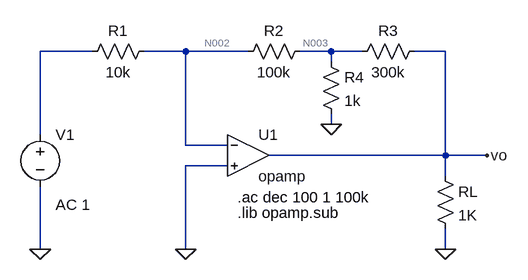
[diagram p0: schematic Ej_1_b.asc]
Ej_1_b.asc, the LTspice schematic file:
Version 4
SHEET 1 880 680
WIRE -128 16 -208 16
WIRE 16 16 -48 16
WIRE 112 16 16 16
WIRE 240 16 192 16
WIRE 288 16 240 16
WIRE 416 16 368 16
WIRE 240 32 240 16
WIRE 240 128 240 112
WIRE -208 144 -208 16
WIRE 16 160 16 16
WIRE 80 160 16 160
WIRE 416 176 416 16
WIRE 416 176 144 176
WIRE 480 176 416 176
WIRE 80 192 16 192
WIRE 416 208 416 176
WIRE -208 320 -208 224
WIRE 16 320 16 192
WIRE 416 320 416 288
FLAG 16 320 0
FLAG -208 320 0
FLAG 480 176 vo
FLAG 416 320 0
FLAG 240 128 0
SYMBOL res -32 0 R90
WINDOW 0 0 56 VBottom 2
WINDOW 3 32 56 VTop 2
SYMATTR InstName R1
SYMATTR Value 10k
SYMBOL res 208 0 R90
WINDOW 0 0 56 VBottom 2
WINDOW 3 32 56 VTop 2
SYMATTR InstName R2
SYMATTR Value 100k
SYMBOL voltage -208 128 R0
WINDOW 3 24 152 Left 2
WINDOW 123 24 124 Left 2
WINDOW 39 0 0 Left 0
SYMATTR Value ""
SYMATTR Value2 AC 1
SYMATTR InstName V1
SYMBOL OpAmps\\opamp 112 112 R0
SYMATTR InstName U1
SYMBOL res 400 192 R0
SYMATTR InstName RL
SYMATTR Value 1K
SYMBOL res 224 16 R0
SYMATTR InstName R4
SYMATTR Value 1k
SYMBOL res 384 0 R90
WINDOW 0 0 56 VBottom 2
WINDOW 3 32 56 VTop 2
SYMATTR InstName R3
SYMATTR Value 300k
TEXT 96 240 Left 2 !.ac dec 100 1 100k
TEXT 96 264 Left 2 !.lib opamp.sub

The netlist it stands for:
* Ej_1_b.asc
R1 N002 N001 10k
R2 N003 N002 100k
V1 N001 0 AC 1
XU1 N002 0 vo opamp Aol=100K GBW=10Meg  ; pins invin noninvin out
RL vo 0 1K
R4 N003 0 1k
R3 vo N003 300k
.ac dec 100 1 100k
.lib opamp.sub
.backanno
.end

* Results of the author's LTspice run, read from the files saved beside the schematic
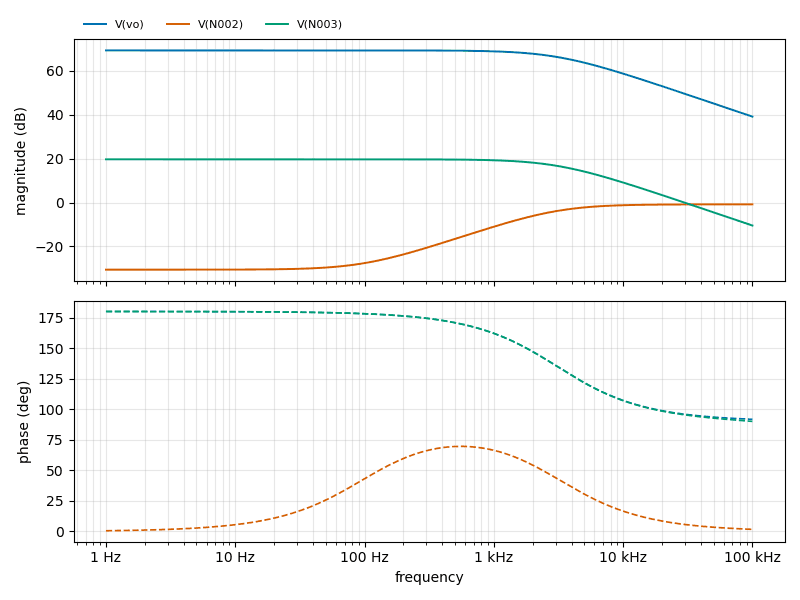
[diagram p1: AC Analysis of Ej_1_b.asc, plotted from the saved traces]
* AC Analysis, 1 run:
*   V(vo): 69.37 dB at 1 Hz, 39.18 dB at 100 kHz, peak 69.37 dB at 1 Hz, 3 dB below the peak at 3.093 kHz
*   V(N002): -30.62 dB at 1 Hz, -0.82 dB at 100 kHz, peak -0.82 dB at 100 kHz, 3 dB below the peak at 3.087 kHz
*   V(N003): 19.71 dB at 1 Hz, -10.48 dB at 100 kHz, peak 19.71 dB at 1 Hz, 3 dB below the peak at 3.093 kHz